# EAGLE design Micromouse-v15 (EAGLE 5.05)
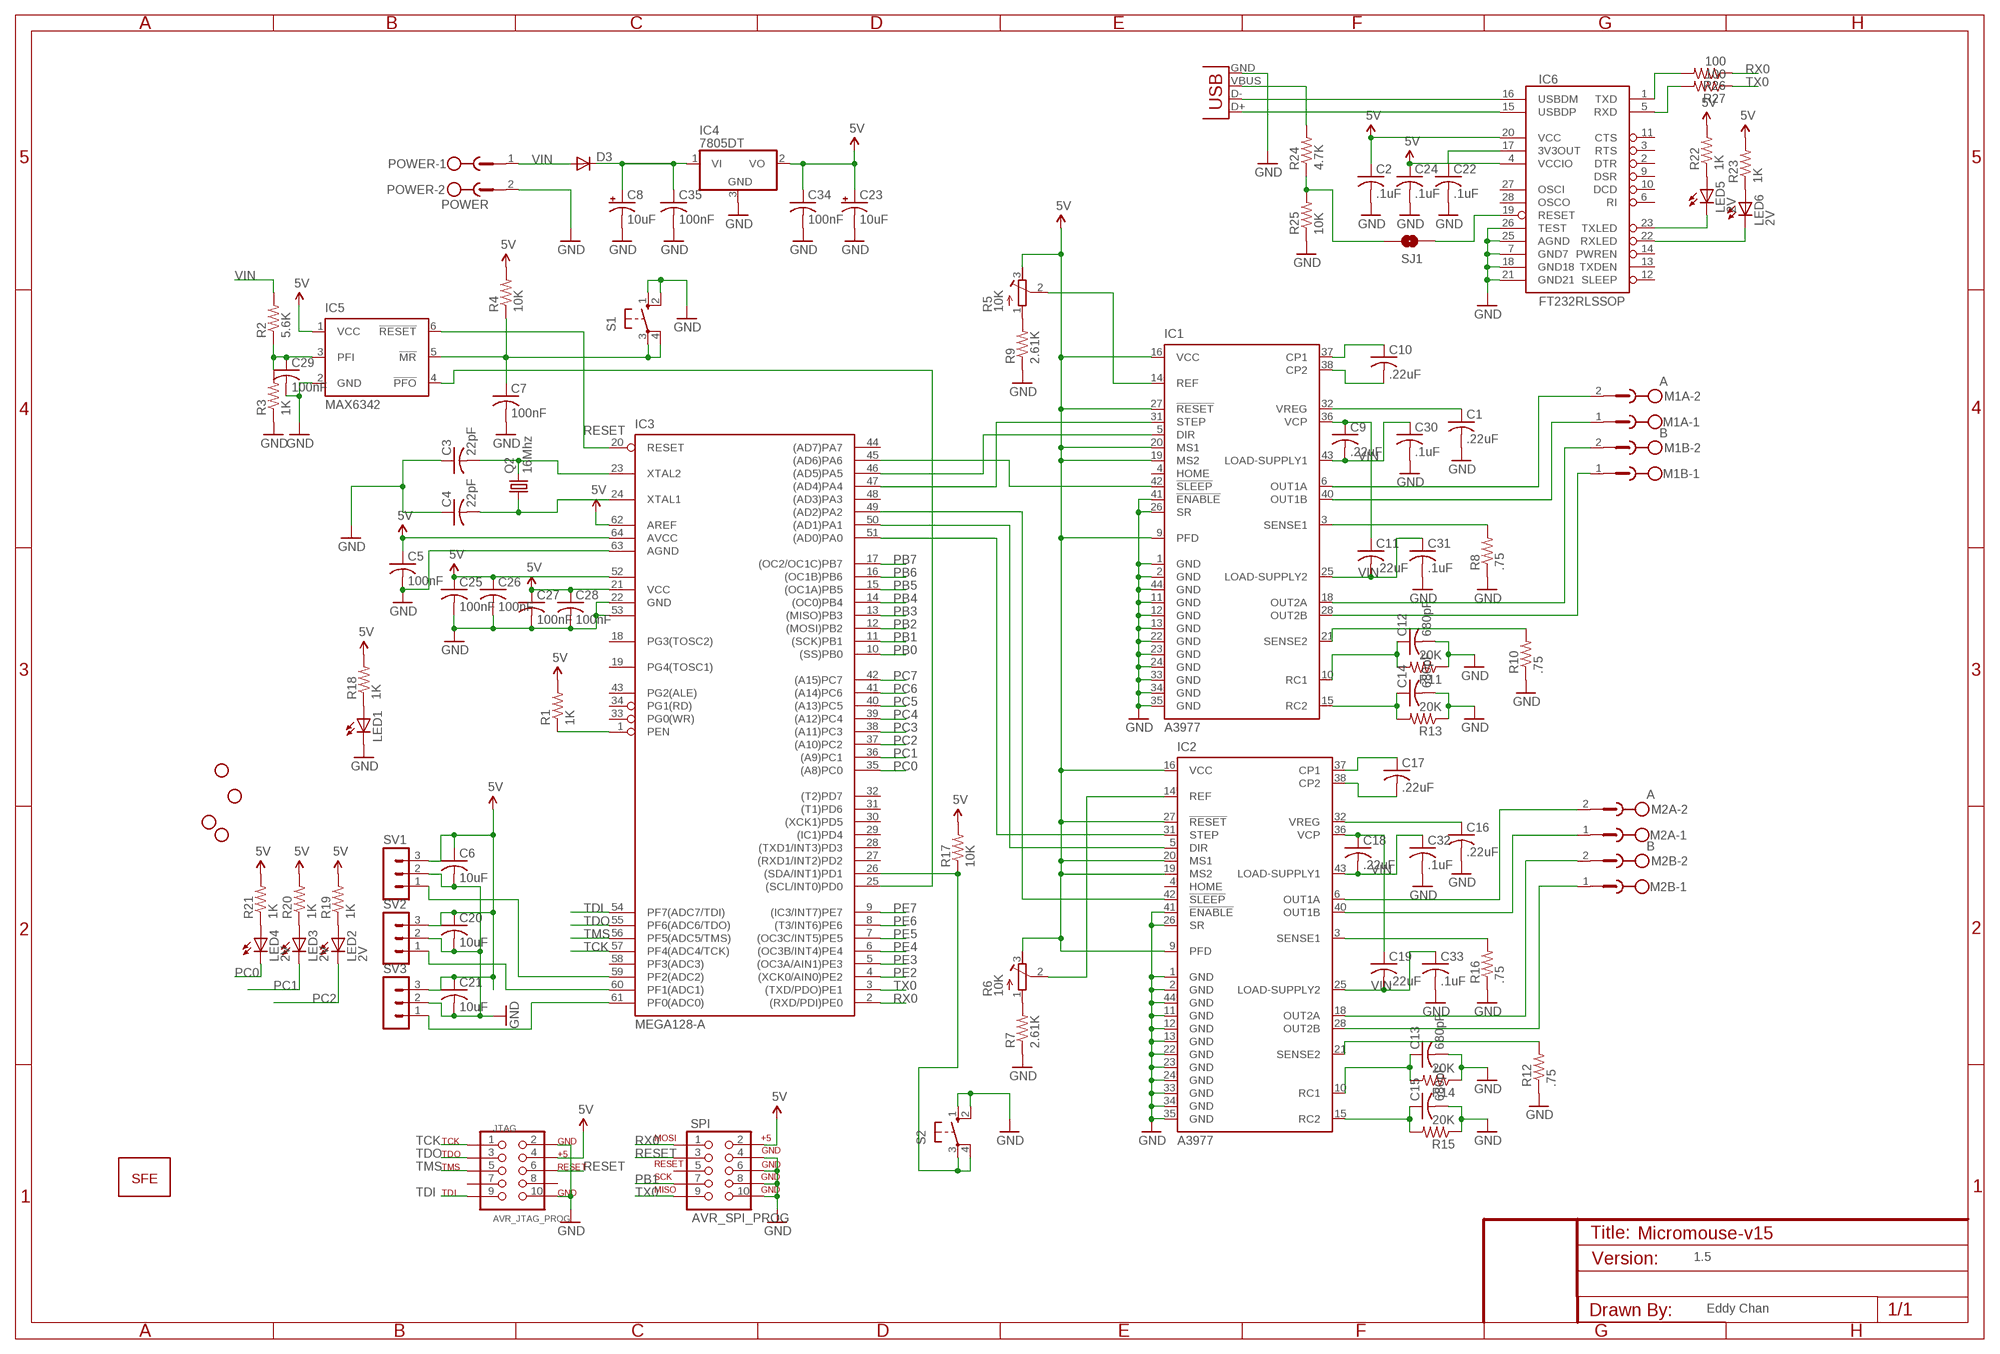
[diagram p0: schematic, sheet 1]

## Parts
C1  .22uF  C-USC0805  [C0805]
C2  .1uF  C-USC0805  [C0805]
C3  22pF  C-USC0805  [C0805]
C4  22pF  C-USC0805  [C0805]
C5  100nF  C-USC0805  [C0805]
C6  10uF  C-USC1206  [C1206]
C7  100nF  C-USC0805  [C0805]
C8  10uF  CAP_POL1206  [EIA3216]
C9  .22uF  C-USC0805  [C0805]
C10  .22uF  C-USC0805  [C0805]
C11  .22uF  C-USC0805  [C0805]
C12  680pF  C-USC0805  [C0805]
C13  680pF  C-USC0805  [C0805]
C14  680pF  C-USC0805  [C0805]
C15  680pF  C-USC0805  [C0805]
C16  .22uF  C-USC0805  [C0805]
C17  .22uF  C-USC0805  [C0805]
C18  .22uF  C-USC0805  [C0805]
C19  .22uF  C-USC0805  [C0805]
C20  10uF  C-USC1206  [C1206]
C21  10uF  C-USC1206  [C1206]
C22  .1uF  C-USC0805  [C0805]
C23  10uF  CAP_POL1206  [EIA3216]
C24  .1uF  C-USC0805  [C0805]
C25  100nF  C-USC0805  [C0805]
C26  100nF  C-USC0805  [C0805]
C27  100nF  C-USC0805  [C0805]
C28  100nF  C-USC0805  [C0805]
C29  100nF  C-USC0805  [C0805]
C30  .1uF  C-USC0805  [C0805]
C31  .1uF  C-USC0805  [C0805]
C32  .1uF  C-USC0805  [C0805]
C33  .1uF  C-USC0805  [C0805]
C34  100nF  C-USC0805  [C0805]
C35  100nF  C-USC0805  [C0805]
D3  DIODESMB  [SMB-DIODE]
IC1  A3977  [PLCC44]
IC2  A3977  [PLCC44]
IC3  MEGA128-A  [TQFP64]
IC4  7805DT  [TO252]
IC5  MAX6342  [SOT23-6L]
IC6  FT232RLSSOP  [SSOP28DB]
JTAG  AVR_JTAG_PROG  [AVR_ICSP]
LED1  LEDCHIP-LED0805  [CHIP-LED0805]
LED2  2V  LEDCHIP-LED0805  [CHIP-LED0805]
LED3  2V  LEDCHIP-LED0805  [CHIP-LED0805]
LED4  2V  LEDCHIP-LED0805  [CHIP-LED0805]
LED5  2V  LEDCHIP-LED0805  [CHIP-LED0805]
LED6  2V  LEDCHIP-LED0805  [CHIP-LED0805]
M1A  A  MSTBV2  [MSTBV2]
M1B  B  MSTBV2  [MSTBV2]
M2A  A  MSTBV2  [MSTBV2]
M2B  B  MSTBV2  [MSTBV2]
POWER  POWER  MSTBV2  [MSTBV2]
Q2  16Mhz  CRYSTALHC49US  [HC49US]
R1  1K  RESISTOR  [0805]
R2  5.6K  RESISTOR  [0805]
R3  1K  RESISTOR  [0805]
R4  10K  RESISTOR  [0805]
R5  10K  R-TRIMM3103  [RTRIM3103]
R6  10K  R-TRIMM3103  [RTRIM3103]
R7  2.61K  RESISTOR  [0805]
R8  .75  RESISTOR  [0805]
R9  2.61K  RESISTOR  [0805]
R10  .75  RESISTOR  [0805]
R11  20K  RESISTOR  [0805]
R12  .75  RESISTOR  [0805]
R13  20K  RESISTOR  [0805]
R14  20K  RESISTOR  [0805]
R15  20K  RESISTOR  [0805]
R16  .75  RESISTOR  [0805]
R17  10K  RESISTOR  [0805]
R18  1K  RESISTOR  [0805]
R19  1K  RESISTOR  [0805]
R20  1K  RESISTOR  [0805]
R21  1K  RESISTOR  [0805]
R22  1K  RESISTOR  [0805]
R23  1K  RESISTOR  [0805]
R24  4.7K  RESISTOR  [0805]
R25  10K  RESISTOR  [0805]
R26  100  RESISTOR  [0805]
R27  100  RESISTOR  [0805]
S1  10-XX  [B3F-10XX]
S2  10-XX  [B3F-10XX]
SJ1  SOLDERJUMPERNC  [SJ_2S]
SPI  AVR_SPI_PROG  [AVR_ICSP]
SV1  MA03-1  [MA03-1]
SV2  MA03-1  [MA03-1]
SV3  MA03-1  [MA03-1]
U$19  STAND-OFF  [STAND-OFF]
U$20  STAND-OFF  [STAND-OFF]
U$21  STAND-OFF  [STAND-OFF]
U$22  STAND-OFF  [STAND-OFF]
U$23  LOGO-SFESK  [SFE-LOGO-FLAME]
X1  USBSMD  [USB-MINIB]

## Nets
5V: C2.1 C5.1 C6.1 C20.1 C21.1 C23.A(+) C24.1 C25.1 C26.1 C27.1 C28.1 C34.1 IC1.9(PFD) IC1.16(VCC) IC1.19(MS2) IC1.20(MS1) IC1.27(!RESET) IC2.9(PFD) IC2.16(VCC) IC2.19(MS2) IC2.20(MS1) IC2.27(!RESET) IC3.21(VCC) IC3.52(VCC1) IC3.62(AREF) IC3.64(AVCC) IC4.2(VO) IC5.1(VCC) IC6.4(VCCIO) IC6.20(VCC) JTAG.4 R1.2 R4.2 R5.3(A) R6.3(A) R17.2 R18.2 R19.2 R20.2 R21.2 R22.2 R23.2 SPI.2 SV1.3 SV2.3 SV3.3
GND: C1.2 C2.2 C3.1 C4.1 C5.2 C6.2 C7.2 C8.C(-) C12.2 C13.2 C14.2 C15.2 C16.2 C20.2 C21.2 C22.2 C23.C(-) C24.2 C25.2 C26.2 C27.2 C28.2 C29.2 C30.2 C31.2 C32.2 C33.2 C34.2 C35.2 IC1.1(GND) IC1.2(GND) IC1.11(GND) IC1.12(GND) IC1.13(GND) IC1.22(GND) IC1.23(GND) IC1.24(GND) IC1.26(SR) IC1.33(GND) IC1.34(GND) IC1.35(GND) IC1.41(!ENABLE) IC1.44(GND) IC2.1(GND) IC2.2(GND) IC2.11(GND) IC2.12(GND) IC2.13(GND) IC2.22(GND) IC2.23(GND) IC2.24(GND) IC2.26(SR) IC2.33(GND) IC2.34(GND) IC2.35(GND) IC2.41(!ENABLE) IC2.44(GND) IC3.22(GND) IC3.53(GND1) IC3.63(AGND) IC4.3(GND) IC5.2(GND) IC6.7(GND7) IC6.18(GND18) IC6.21(GND21) IC6.25(AGND) IC6.26(TEST) JTAG.2 JTAG.10 LED1.C POWER.2 R3.1 R7.1 R8.1 R9.1 R10.1 R11.1 R12.1 R13.1 R14.1 R15.1 R16.1 R25.1 S1.1(S) S1.2(S1) S2.1(S) S2.2(S1) SPI.4 SPI.6 SPI.8 SPI.10 SV1.2 SV2.2 SV3.2 X1.GND
N$1: IC1.5(DIR) IC3.46((AD5)PA5)
N$2: IC1.31(STEP) IC3.47((AD4)PA4)
N$3: IC2.31(STEP) IC3.51((AD0)PA0)
N$4: IC2.5(DIR) IC3.50((AD1)PA1)
N$5: C8.A(+) C35.1 D3.C IC4.1(VI)
N$6: IC3.1(PEN) R1.1
N$7: C29.1 IC5.3(PFI) R2.1 R3.2
N$8: C3.2 IC3.23(XTAL2) Q2.2
N$9: C4.2 IC3.24(XTAL1) Q2.1
N$10: IC1.42(!SLEEP) IC3.45((AD6)PA6)
N$11: C7.1 IC5.5(!MR) R4.1 S1.3(P) S1.4(P1)
N$12: LED1.A R18.1
N$13: IC2.42(!SLEEP) IC3.49((AD2)PA2)
N$14: IC3.25((SCL/INT0)PD0) IC5.4(!PFO)
N$15: R5.1(E) R9.2
N$16: IC1.14(REF) R5.2(S)
N$17: R6.1(E) R7.2
N$18: IC2.14(REF) R6.2(S)
N$19: IC1.3(SENSE1) R8.2
N$20: IC1.21(SENSE2) R10.2
N$21: C1.1 IC1.32(VREG)
N$22: C10.1 IC1.37(CP1)
N$23: C10.2 IC1.38(CP2)
N$24: C9.1 C11.1 IC1.36(VCP)
N$25: IC2.21(SENSE2) R12.2
N$26: C12.1 IC1.10(RC1) R11.2
N$27: C14.1 IC1.15(RC2) R13.2
N$28: C13.1 IC2.10(RC1) R14.2
N$29: C15.1 IC2.15(RC2) R15.2
N$30: IC2.3(SENSE1) R16.2
N$31: C16.1 IC2.32(VREG)
N$32: C17.1 IC2.37(CP1)
N$33: C17.2 IC2.38(CP2)
N$34: C18.1 C19.1 IC2.36(VCP)
N$35: IC1.6(OUT1A) M1A.2
N$36: IC1.40(OUT1B) M1A.1
N$37: IC1.18(OUT2A) M1B.2
N$38: IC1.28(OUT2B) M1B.1
N$39: IC2.6(OUT1A) M2A.2
N$40: IC2.40(OUT1B) M2A.1
N$41: IC2.18(OUT2A) M2B.2
N$42: IC2.28(OUT2B) M2B.1
N$43: IC3.61(PF0(ADC0)) SV3.1
N$44: IC3.60(PF1(ADC1)) SV2.1
N$45: IC3.59(PF2(ADC2)) SV1.1
N$46: IC3.26((SDA/INT1)PD1) R17.1 S2.3(P) S2.4(P1)
N$47: LED2.A R19.1
N$48: LED3.A R20.1
N$49: LED4.A R21.1
N$50: R24.2 X1.VBUS
N$51: R24.1 R25.2 SJ1.2
N$52: IC6.16(USBDM) X1.D-
N$53: IC6.15(USBDP) X1.D+
N$54: C22.1 IC6.17(3V3OUT)
N$55: LED5.A R22.1
N$56: LED6.A R23.1
N$57: IC6.23(TXLED) LED5.C
N$58: IC6.22(RXLED) LED6.C
N$59: IC6.1(TXD) R26.2
N$60: IC6.5(RXD) R27.2
N$61: IC6.19(RESET) SJ1.1
PB0: IC3.10((SS)PB0)
PB1: IC3.11((SCK)PB1) SPI.7
PB2: IC3.12((MOSI)PB2)
PB3: IC3.13((MISO)PB3)
PB4: IC3.14((OC0)PB4)
PB5: IC3.15((OC1A)PB5)
PB6: IC3.16((OC1B)PB6)
PB7: IC3.17((OC2/OC1C)PB7)
PC0: IC3.35((A8)PC0) LED4.C
PC1: IC3.36((A9)PC1) LED3.C
PC2: IC3.37((A10)PC2) LED2.C
PC3: IC3.38((A11)PC3)
PC4: IC3.39((A12)PC4)
PC5: IC3.40((A13)PC5)
PC6: IC3.41((A14)PC6)
PC7: IC3.42((A15)PC7)
PE2: IC3.4((XCK0/AIN0)PE2)
PE3: IC3.5((OC3A/AIN1)PE3)
PE4: IC3.6((OC3B/INT4)PE4)
PE5: IC3.7((OC3C/INT5)PE5)
PE6: IC3.8((T3/INT6)PE6)
PE7: IC3.9((IC3/INT7)PE7)
RESET: IC3.20(RESET) IC5.6(!RESET) JTAG.6 SPI.3
RX0: IC3.2((RXD/PDI)PE0) R26.1 SPI.1
TCK: IC3.57(PF4(ADC4/TCK)) JTAG.1
TDI: IC3.54(PF7(ADC7/TDI)) JTAG.9
TDO: IC3.55(PF6(ADC6/TDO)) JTAG.3
TMS: IC3.56(PF5(ADC5/TMS)) JTAG.5
TX0: IC3.3((TXD/PDO)PE1) R27.1 SPI.9
VIN: C9.2 C11.2 C18.2 C19.2 C30.1 C31.1 C32.1 C33.1 D3.A IC1.25(LOAD-SUPPLY2) IC1.43(LOAD-SUPPLY1) IC2.25(LOAD-SUPPLY2) IC2.43(LOAD-SUPPLY1) POWER.1 R2.2
Unconnected: IC1.4(HOME) IC2.4(HOME) IC3.18(PG3(TOSC2)) IC3.19(PG4(TOSC1)) IC3.27((RXD1/INT2)PD2) IC3.28((TXD1/INT3)PD3) IC3.29((IC1)PD4) IC3.30((XCK1)PD5) IC3.31((T1)PD6) IC3.32((T2)PD7) IC3.33(PG0(WR)) IC3.34(PG1(RD)) IC3.43(PG2(ALE)) IC3.44((AD7)PA7) IC3.48((AD3)PA3) IC3.58(PF3(ADC3)) IC6.2(DTR) IC6.3(RTS) IC6.6(RI) IC6.9(DSR) IC6.10(DCD) IC6.11(CTS) IC6.12(SLEEP) IC6.13(TXDEN) IC6.14(PWREN) IC6.27(OSCI) IC6.28(OSCO) JTAG.7 JTAG.8 SPI.5

## Notes on the sheet
- 1.5
- Eddy Chan

## Library data of the parts
C1-C7 C9-C22 C24-C35 = rcl:C-US: CAPACITOR, American symbol
C8 C23 = SparkFun:CAP_POL: Capacitor Polarized These are standard SMD and PTH capacitors. Normally 10uF, 47uF, and 100uF in electrolytic and tantalum varieties. Always verify the external diameter of the through hole cap, it varies with capacity, voltage, and manufacturer. The EIA devices should be standard.
D3 = SparkFun:DIODE: Diode These are standard reverse protection diodes and small signal diodes. SMA package can handle up to about 1A. SOD-323 can handle about 200mA. What the SOD-323 package when ordering, there are some mfgs out there that are 5-pin packages.
IC1 IC2 = allegro:A3977: MICROSTEPPING DMOS DRIVER WITH TRANSLATOR Source: 3977.pdf
IC3 = atmel:MEGA128: MICROCONTROLLER 128 Kbytes FLASH 4 Kbytes SRAM 4 Kbytes EEPROM DUAL USART 8-channel 10 bit ADC Source: avr.lbr
IC4 = linear:78*: Positive VOLTAGE REGULATOR Source: http://cache.national.com/ds/LM/LM78L05.pdf http://www.fairchildsemi.com/ds/LM/LM7805.pdf
IC5 = maxim:MAX6342: RESET CIRCUIT
IC6 = SparkFun:FT232RL: USB UART FT232RL 4th Generation USB UART (USB <-> Serial) Controller. Spark Fun Electronics SKU : COM-00650
JTAG = SparkFun:AVR_JTAG_PROG
LED1-LED6 = led:LED: LED OSRAM: - CHIPLED LG R971, LG N971, LY N971, LG Q971, LY Q971, LO R971, LY R971 LH N974, LH R974 LS Q976, LO Q976, LY Q976 LO Q996 - Hyper CHIPLED LW Q18S LB Q993, LB Q99A, LB R99A - SideLED LS A670, LO A670, LY A670, LG A670, LP A670 LB A673, LV A673, LT A673, LW A673 LH A674 LY A675 LS A676, LA A676, LO A676, LY A676, LW A676 LS A679, LY A679, LG A679 - Hyper Micro SIDELED® LS Y876, LA Y876, LO Y876, LY Y876 LT Y87S - SmartLED LW L88C, LW L88S LB L89C, LB L89S, LG L890 LS L89K, LO L89K, LY L89K LS L896, LA L896, LO L896, LY L896 - TOPLED LS T670, LO T670, LY T670, LG T670, LP T670 LSG T670, LSP T670, LSY T670, LOP T670, LYG T670 LG T671, LOG T671, LSG T671 LB T673, LV T673, LT T673, LW T673 LH T674 LS T676, LA T676, LO T676, LY T676, LB T676, LH T676, LSB T676, LW T676 LB T67C, LV T67C, LT T67C, LS T67K, LO T67K, LY T67K, LW E67C LS E67B, LA E67B, LO E67B, LY E67B, LB E67C, LV E67C, LT E67C LW T67C LS T679, LY T679, LG T679 LS T770, LO T770, LY T770, LG T770, LP T770 LB T773, LV T773, LT T773, LW T773 LH T774 LS E675, LA E675, LY E675, LS T675 LS T776, LA T776, LO T776, LY T776, LB T776 LHGB T686 LT T68C, LB T68C - Hyper Mini TOPLED® LB M676 - Mini TOPLED Santana® LG M470 LS M47K, LO M47K, LY M47K Source: http://www.osram.convergy.de LUXEON: - LUMILED® LXK2-PW12-R00, LXK2-PW12-S00, LXK2-PW14-U00, LXK2-PW14-V00 LXK2-PM12-R00, LXK2-PM12-S00, LXK2-PM14-U00 LXK2-PE12-Q00, LXK2-PE12-R00, LXK2-PE12-S00, LXK2-PE14-T00, LXK2-PE14-U00 LXK2-PB12-K00, LXK2-PB12-L00, LXK2-PB12-M00, LXK2-PB14-N00, LXK2-PB14-P00, LXK2-PB14-Q00 LXK2-PR12-L00, LXK2-PR12-M00, LXK2-PR14-Q00, LXK2-PR14-R00 LXK2-PD12-Q00, LXK2-PD12-R00, LXK2-PD12-S00 LXK2-PH12-R00, LXK2-PH12-S00 LXK2-PL12-P00, LXK2-PL12-Q00, LXK2-PL12-R00 Source: www.luxeon.com KINGBRIGHT: KA-3528ASYC Source: www.kingbright.com
M1A M1B M2A M2B POWER = con-phoenix-500:MSTBV2: PHOENIX
Q2 = SparkFun:CRYSTAL: Crystals Various standard crystals. Proven footprints. Spark Fun Electronics SKU : COM-00534
R1-R4 R7-R27 = SparkFun:RESISTOR: Resistor Basic schematic elements and footprints for 0603, 1206, and PTH 1/10th watt (small) resistors.
R5 R6 = rcl:R-TRIMM: Trimm resistor
S1 S2 = switch-omron:10-XX: OMRON SWITCH
SJ1 = SparkFun:SOLDERJUMPER: Solder Jumper Standard SMD solder jumper. Used to automate production. Two varients : Normally Open and Normally Closed are the same, but have different paste layers. NC will have a large amount of paste and should jumper during reflow.
SPI = SparkFun:AVR_SPI_PROG: AVR ICSP Header This is the standard AVR In Circuit Serial Programming header. Minimal, but includes pin one indicator. Works with standard Olimex programmers. Also look for the 6-pin reduced version. Spark Fun Electronics SKU: PRT-00778
SV1-SV3 = con-lstb:MA03-1: PIN HEADER
U$19-U$22 = SparkFun:STAND-OFF: Stand Off This is the mechanical footprint for a #4 phillips button head screw. Use the keepout ring to avoid running the screw head into surrounding components. SKU : PRT-00447
U$23 = SparkFun:LOGO-SFE: Spark Fun Electronics PCB Logo This is the standard Spark Fun Electronics PCB logo.
X1 = SparkFun:USB: USB Connectors USB-B-PTH is fully proven SKU : PRT-00139 USB-miniB is fully proven SKU : PRT-00587 USB-A-PCB is untested. USB-A-H is throughly reviewed, but untested. Spark Fun Electronics SKU : PRT-00437 USB-B-SMT is throughly reviewed, but untested. Needs silkscreen touching up. USB-A-S has not been used/tested USB-MB-H has not been used/tested

## Board
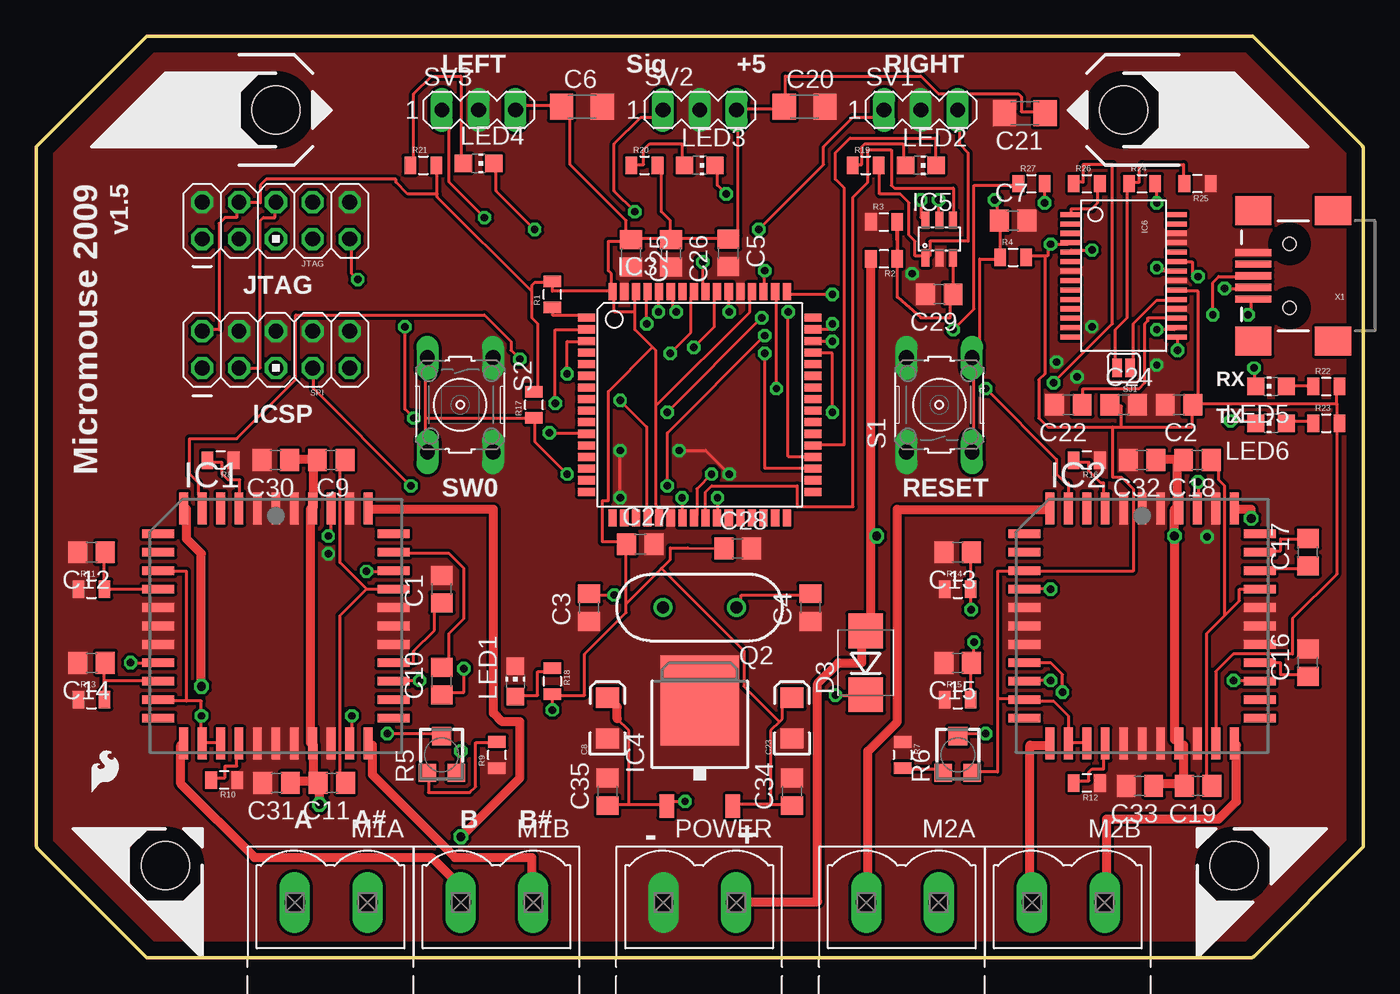
[diagram p1: board, top side]
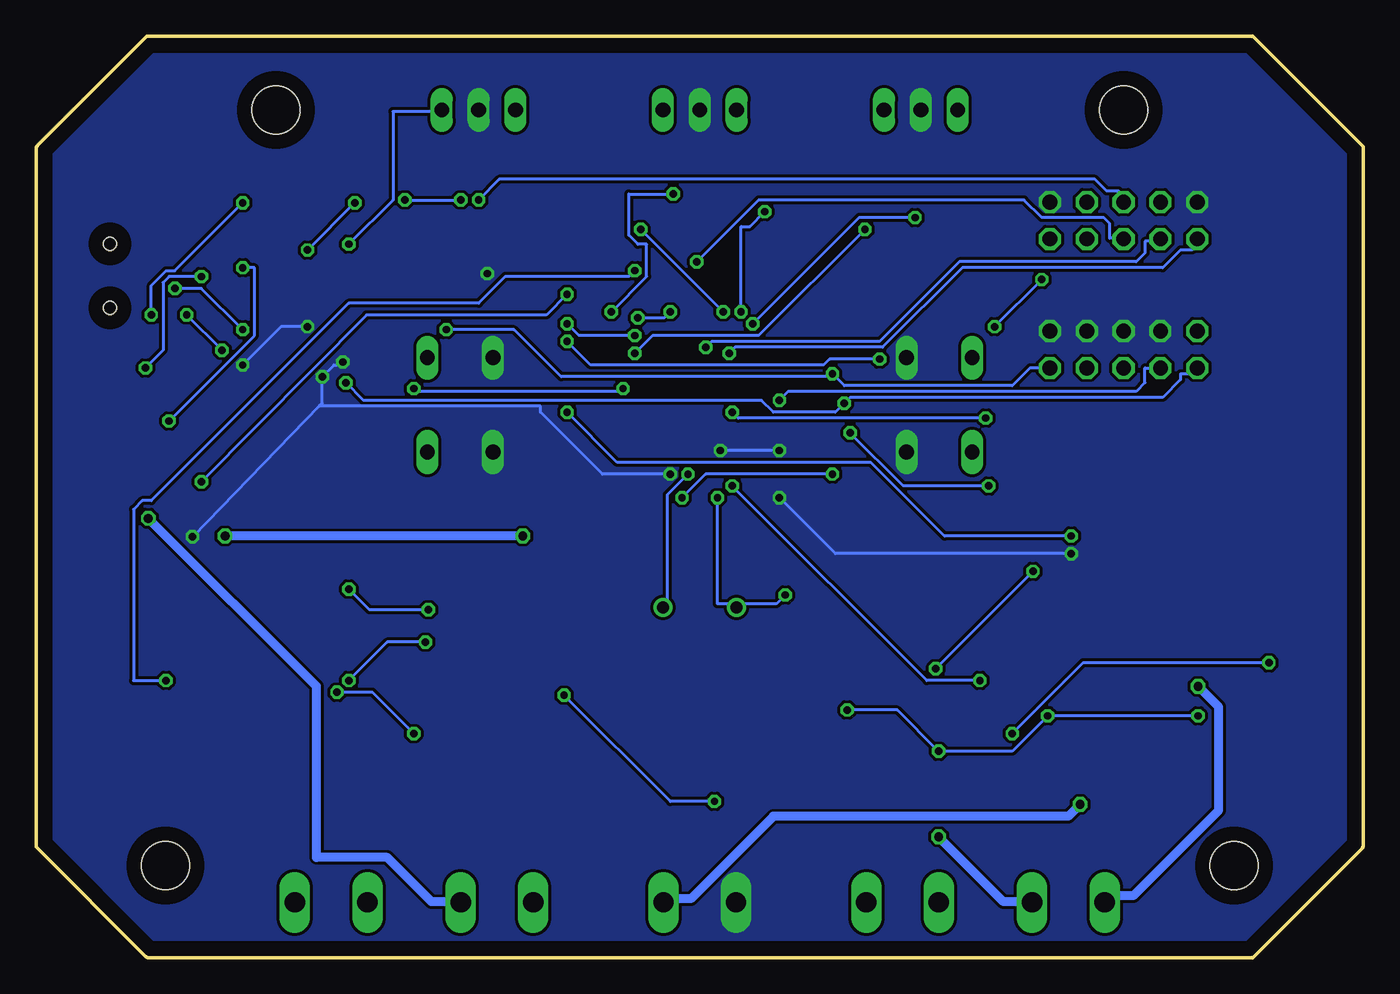
[diagram p2: board, bottom side, seen from below]

Size 91.44 x 63.5 mm. Coordinates in mm from the lower left corner, seen from the top.
Outline: 7.62,63.5 0,55.88 0,7.72 arc45 0.07,7.55 7.62,0 83.72,0 arc45 83.89,0.07 91.44,7.62 91.44,55.77 arc45 91.37,55.95 83.82,63.5 7.62,63.5
Copper layers (1*16): Top 0.035mm / dielectric 1.5mm / Bottom 0.035mm
Design rules "default *": minimum track width 8mil, minimum drill 8mil, track to track 8mil, track to pad 8mil, pad to pad 8mil, via to via 8mil, smd to smd 8mil, copper to edge 40mil, drill to drill 8mil, minimum pad ring 10mil, minimum via ring 8mil, stop-mask expansion 4mil, vias tented up to drill 0mil, thermal gap 10mil

### Footprints (pad centres in the part's own frame; a part is rotated, then mirrored left to right if it is on the bottom)
C0805 = smd 1.3 x 1.5: 1 -0.95,0; 2 0.95,0
C1206 = smd 1.6 x 1.8: 1 -1.4,0; 2 1.4,0
EIA3216 = smd 1.4 x 1.6: A 1.4,0; C -1.4,0
SMB-DIODE = smd 2.4 x 2.4: A 2.2,0; C -2.2,0
PLCC44 = smd 0.6 x 2.2: 1 0,8.1; 2 -1.27,8.1; 3 -2.54,8.1; 4 -3.81,8.1; 5 -5.08,8.1; 6 -6.35,8.1; 18 -6.35,-8.1; 19 -5.08,-8.1; 20 -3.81,-8.1; 21 -2.54,-8.1; 22 -1.27,-8.1; 23 0,-8.1; 24 1.27,-8.1; 25 2.54,-8.1; 26 3.81,-8.1; 27 5.08,-8.1; 28 6.35,-8.1; 40 6.35,8.1; 41 5.08,8.1; 42 3.81,8.1; 43 2.54,8.1; 44 1.27,8.1 | smd 2.2 x 0.6: 7 -8.1,6.35; 8 -8.1,5.08; 9 -8.1,3.81; 10 -8.1,2.54; 11 -8.1,1.27; 12 -8.1,0; 13 -8.1,-1.27; 14 -8.1,-2.54; 15 -8.1,-3.81; 16 -8.1,-5.08; 17 -8.1,-6.35; 29 8.1,-6.35; 30 8.1,-5.08; 31 8.1,-3.81; 32 8.1,-2.54; 33 8.1,-1.27; 34 8.1,0; 35 8.1,1.27; 36 8.1,2.54; 37 8.1,3.81; 38 8.1,5.08; 39 8.1,6.35
TQFP64 = smd 1.194 x 0.559: 1 -7.8,6; 2 -7.8,5.2; 3 -7.8,4.4; 4 -7.8,3.6; 5 -7.8,2.8; 6 -7.8,2; 7 -7.8,1.2; 8 -7.8,0.4; 9 -7.8,-0.4; 10 -7.8,-1.2; 11 -7.8,-2; 12 -7.8,-2.8; 13 -7.8,-3.6; 14 -7.8,-4.4; 15 -7.8,-5.2; 16 -7.8,-6; 33 7.8,-6; 34 7.8,-5.2; 35 7.8,-4.4; 36 7.8,-3.6; 37 7.8,-2.8; 38 7.8,-2; 39 7.8,-1.2; 40 7.8,-0.4; 41 7.8,0.4; 42 7.8,1.2; 43 7.8,2; 44 7.8,2.8; 45 7.8,3.6; 46 7.8,4.4; 47 7.8,5.2; 48 7.8,6 | smd 0.559 x 1.194: 17 -6,-7.8; 18 -5.2,-7.8; 19 -4.4,-7.8; 20 -3.6,-7.8; 21 -2.8,-7.8; 22 -2,-7.8; 23 -1.2,-7.8; 24 -0.4,-7.8; 25 0.4,-7.8; 26 1.2,-7.8; 27 2,-7.8; 28 2.8,-7.8; 29 3.6,-7.8; 30 4.4,-7.8; 31 5.2,-7.8; 32 6,-7.8; 49 6,7.8; 50 5.2,7.8; 51 4.4,7.8; 52 3.6,7.8; 53 2.8,7.8; 54 2,7.8; 55 1.2,7.8; 56 0.4,7.8; 57 -0.4,7.8; 58 -1.2,7.8; 59 -2,7.8; 60 -2.8,7.8; 61 -3.6,7.8; 62 -4.4,7.8; 63 -5.2,7.8; 64 -6,7.8
TO252 = smd 1 x 1.6: 1 -2.28,-4.8; 2 2.28,-4.8 | smd 5.4 x 6.2: 3 0,2.5
SOT23-6L = smd 0.55 x 1.2: 1 -0.95,-1.3; 2 0,-1.3; 3 0.95,-1.3; 4 0.95,1.3; 5 0,1.3; 6 -0.95,1.3
SSOP28DB = smd 0.348 x 1.397: 1 -4.225,-3.656; 2 -3.575,-3.656; 3 -2.925,-3.656; 4 -2.275,-3.656; 5 -1.625,-3.656; 6 -0.975,-3.656; 7 -0.325,-3.656; 8 0.325,-3.656; 9 0.975,-3.656; 10 1.625,-3.656; 11 2.275,-3.656; 12 2.925,-3.656; 13 3.575,-3.656; 14 4.225,-3.656; 15 4.225,3.656; 16 3.575,3.656; 17 2.925,3.656; 18 2.275,3.656; 19 1.625,3.656; 20 0.975,3.656; 21 0.325,3.656; 22 -0.325,3.656; 23 -0.975,3.656; 24 -1.625,3.656; 25 -2.275,3.656; 26 -2.925,3.656; 27 -3.575,3.656; 28 -4.225,3.656
AVR_ICSP = drill 1.016 octagon: 1 -1.27,5.08; 2 1.27,5.08; 3 -1.27,2.54; 4 1.27,2.54; 5 -1.27,0; 6 1.27,0; 7 -1.27,-2.54; 8 1.27,-2.54; 9 -1.27,-5.08; 10 1.27,-5.08
CHIP-LED0805 = smd 1.2 x 1.2: A 0,-1.05; C 0,1.05
MSTBV2 = drill 1.397 long: 1 -2.5,0; 2 2.5,0
HC49US = drill 0.813 round: 1 -2.54,0; 2 2.54,0
0805 = smd 0.8 x 1.2: 1 -0.9,0; 2 0.9,0
RTRIM3103 = smd 1.2 x 1.25: 1 -1,-1.225; 3 1,-1.225 | smd 1.3 x 1.3: 2 0,1.3
B3F-10XX = drill 1.016 long: 1 -3.251,2.261; 2 3.251,2.261; 3 -3.251,-2.261; 4 3.251,-2.261
SJ_2S = smd 0.635 x 1.27: 1 -0.45,0; 2 0.45,0
MA03-1 = drill 1.016 long: 1 -2.54,0; 2 0,0; 3 2.54,0
STAND-OFF = hole 3.302: 0,0
USB-MINIB = smd 2.5 x 0.5: D+ 2.5,0; D- 2.5,0.8; GND 2.5,-1.6; ID 2.5,-0.8; VBUS 2.5,1.6 | smd 2.5 x 2: GND@1 -3,-4.5; GND@2 -3,4.5; GND@3 2.5,4.5; GND@4 2.5,-4.5 | hole 0.9: 0,2.2; 0,-2.2

### Placement (x,y rotation side)
C1  27.94,25.4 90 top
C2  78.74,38.1 180 top
C3  38.1,24.13 90 top
C4  53.34,24.13 90 top
C5  47.68,48.57 270 top
C6  37.6,58.64 0 top
C7  67.31,50.8 0 top
C8  39.37,16.51 90 top
C9  20.32,34.29 180 top
C10  27.94,19.05 90 top
C11  20.37,12.04 180 top
C12  3.81,27.94 180 top
C13  63.5,27.94 180 top
C14  3.81,20.32 180 top
C15  63.5,20.32 180 top
C16  87.63,20.32 90 top
C17  87.63,27.94 90 top
C18  80.01,34.29 180 top
C19  80.06,11.84 180 top
C20  52.94,58.64 0 top
C21  68.12,58.2 180 top
C22  71.12,38.1 180 top
C23  52.07,16.51 90 top
C24  74.93,38.1 0 top
C25  40.99,48.54 270 top
C26  43.74,48.54 270 top
C27  41.62,28.49 0 top
C28  48.33,28.21 0 top
C29  62.23,45.72 180 top
C30  16.51,34.29 180 top
C31  16.56,12.04 180 top
C32  76.2,34.29 180 top
C33  76.05,11.84 180 top
C34  52.07,11.43 90 top
C35  39.37,11.43 90 top
D3  57.15,20.32 90 top
IC1  16.51,22.86 0 top
IC2  76.2,22.86 0 top
IC3  45.72,38.1 0 top
IC4  45.72,15.24 0 top
IC5  62.23,49.53 0 top
IC6  74.93,46.99 270 top
JTAG  16.51,50.8 90 top
LED1  33.02,19.05 0 top
LED2  60.96,54.61 270 top
LED3  45.72,54.61 270 top
LED4  30.48,54.74 270 top
LED5  85.09,39.37 90 top
LED6  85.09,36.83 90 top
M1A  20.32,3.81 180 top
M1B  31.75,3.81 180 top
M2A  59.69,3.81 180 top
M2B  71.12,3.81 180 top
POWER  45.72,3.81 180 top
Q2  45.72,24.13 180 top
R1  35.56,45.72 90 top
R2  58.42,48.16 180 top
R3  58.42,50.7 0 top
R4  67.31,48.26 0 top
R5  27.94,13.97 0 top
R6  63.5,13.97 0 top
R7  59.69,13.97 270 top
R8  12.7,34.29 180 top
R9  31.75,13.97 90 top
R10  12.95,12.24 180 top
R11  3.81,25.4 0 top
R12  72.39,12.04 180 top
R13  3.81,17.78 0 top
R14  63.5,25.4 0 top
R15  63.5,17.78 0 top
R16  72.39,34.29 180 top
R17  34.29,38.1 90 top
R18  35.56,19.05 270 top
R19  57.15,54.61 0 top
R20  41.91,54.61 0 top
R21  26.67,54.61 0 top
R22  88.9,39.37 0 top
R23  88.9,36.83 0 top
R24  76.2,53.34 0 top
R25  80.01,53.34 180 top
R26  72.39,53.34 0 top
R27  68.58,53.34 0 top
S1  62.23,38.1 90 top
S2  29.21,38.1 270 top
SJ1  74.93,40.64 180 top
SPI  16.51,41.91 90 top
SV1  60.96,58.42 0 top
SV2  45.72,58.42 0 top
SV3  30.48,58.42 0 top
U$19  8.89,6.35 0 top
U$20  82.55,6.35 0 top
U$21  16.51,58.42 0 top
U$22  74.93,58.42 0 top
U$23  3.81,11.43 0 top
X1  86.36,46.99 180 top

### Tracks (layer width: path | path; a pad name or v marks a point on that pad's centre or on a via)
5V  (via drill 0.51)
  Top 0.203: IC1.20 12.6,14.83 11.58,14.83 IC1.19 11.38,14.83 v11.38,16.66 11.38,17.68 10.36,17.68 | 10.36,17.68 8.53,17.68 IC1.16 | 10.36,17.68 10.36,26.62 8.53,26.62 IC1.9 | 50.6,10.57 48.16,10.57 IC4.2 | 50.6,10.57 52.02,10.57 C34.1 | 51.21,16.26 50.6,15.65 50.6,10.57 | 51.21,16.26 51.41,16.46 51.41,17.27 52.02,17.88 C23.A | 35.56,18.09 37.8,18.09 37.8,20.93 40.64,23.77 40.64,24.38 | 40.64,24.38 40.64,28.45 C27.1 40.64,28.65 39.01,28.65 39.01,31.5 39.42,31.5 39.42,39.01 42.47,42.06 | v29.26,14.22 29.26,13.01 29.06,12.8 R5.3 | v35.56,17.07 35.56,18.09 | 35.56,18.09 R18.2 | 40.64,24.38 43.08,26.82 | 43.08,26.82 43.69,27.43 43.69,28.25 44.91,28.25 C28.1 | v21.74,16.66 21.74,14.83 IC1.27 | 51.21,16.26 48.77,18.69 48.77,21.13 43.08,26.82 | 71.12,14.83 72.34,14.83 IC2.20 | 66.24,17.88 66.24,12.8 64.62,12.8 R6.3 | 66.24,17.88 68.07,17.88 IC2.16 68.28,17.68 70.1,17.68 71.12,16.66 71.12,14.83 | 66.24,17.88 66.24,26.62 68.07,26.62 IC2.9 68.28,26.62 75.59,26.62 75.59,32.31 74.78,33.12 74.17,33.12 74.17,36.58 | 71.12,14.83 IC2.19 | 69.49,48.36 69.7,48.36 69.7,48.97 v69.9,49.17 71.12,49.17 IC6.4 | 69.49,48.36 68.28,48.36 R4.2 | 89.61,38.2 89.61,39.22 R22.2 | 89.61,38.2 89.61,36.98 R23.2 89.61,36.78 89.61,26.42 86.56,23.37 86.56,20.93 82.5,20.93 81.28,19.71 IC2.27 | 79.86,38.2 80.06,38.41 80.06,45.92 78.64,45.92 IC6.20 | 74.78,36.58 74.78,38 74.17,38 C24.1 | 74.78,36.58 79.65,36.58 79.65,38 C2.1 79.86,38.2 | 79.86,38.2 89.61,38.2 | 69.49,48.36 69.49,40.23 69.09,39.83 69.09,37.19 69.7,36.58 74.17,36.58 | 74.17,36.58 74.78,36.58 | R19.2 58.12,54.46 58.12,52.63 59.54,52.63 60.15,52.02 60.15,49.78 60.55,49.38 60.55,48.36 61.16,48.36 IC5.1 61.37,48.36 61.57,48.36 61.57,49.38 64.21,49.38 64.21,55.47 63.6,56.08 63.6,58.32 SV1.3
  Top 0.203: 63.6,59.54 67.67,59.54 67.87,59.33 67.87,58.32 69.49,58.32 C21.1 | 63.6,59.54 63.6,58.52 SV1.3 | SV3.3 33.12,58.52 33.12,58.73 36.17,58.73 C6.1 36.37,58.52 36.78,58.12 36.78,54.66 40.64,50.8 40.64,49.78 40.84,49.58 C25.1 | 63.6,59.54 62.18,59.54 60.96,60.76 51.61,60.76 51.61,58.73 C20.1 51.41,58.52 48.36,58.52 SV2.3 48.36,58.32 48.36,49.78 48.16,49.58 C5.1 47.95,49.58 43.89,49.58 C26.1 43.69,49.58 | 63.6,59.54 SV1.3 | 41.25,44.5 39.83,44.5 39.83,45.72 IC3.64 39.62,45.92 | 41.25,44.5 41.25,45.72 IC3.62 | 42.67,38 42.67,41.86 42.47,42.06 | 42.67,38 42.67,31.29 42.88,30.48 IC3.21 | 42.47,42.06 41.25,43.28 41.25,44.5 | 42.67,38 49.17,44.5 49.17,45.72 IC3.52 | 43.69,49.58 43.69,50.8 43.08,51.41 43.08,54.25 42.88,54.46 R20.2 | 43.69,49.58 41.05,49.58 C25.1 | 39.62,45.92 39.62,47.14 39.42,47.35 39.42,49.38 40.84,49.38 C25.1 | SPI.2 11.58,43.28 12.6,43.28 12.6,50.6 13.01,51 13.82,51 13.82,52.02 JTAG.4 14.02,52.02 15.44,52.02 15.44,53.24 15.85,53.65 24.79,53.65 24.79,53.44 25.6,52.63 27.64,52.63 | 34.14,45.92 34.14,46.33 34.34,46.53 35.56,46.53 | 34.14,45.92 34.14,44.09 34.54,43.69 34.54,39.22 34.34,39.01 R17.2 | 27.64,52.63 27.64,52.43 34.14,45.92 | 27.64,52.63 27.64,54.46 R21.2 | 39.62,45.92 35.56,45.92 35.56,46.53 | 35.56,46.53 R1.2
  Bottom 0.203: v35.56,17.07 32.11,17.07 v29.26,14.22 24.18,14.22 v21.74,16.66 v11.38,16.66 | v69.9,49.17 66.85,52.22 66.85,58.32 63.6,58.32 SV1.3
GND  (via drill 0.51)
  Top 0.203: v47.75,33.33 46.13,34.95 v44.3,34.95 | v40.23,31.7 v40.23,34.95
  Bottom 0.203: v77.22,40.84 74.57,43.48 v72.75,43.48 | v70.31,41.05 70.51,40.84 70.92,40.84 v71.73,40.03 71.73,38.2 71.93,38 | 71.93,38 v80.67,29.01 | 71.93,38 56.69,38 56.69,37.59 52.43,33.33 v47.75,33.33 | v40.23,34.95 v44.3,34.95 | v40.23,31.7 36.37,27.84 v20.12,27.84
  other vias: 60.35,47.14
  pour Top (no thermals): 0.41,55.68 0.41,7.72 7.72,0.41 83.72,0.41 91.03,7.72 91.03,55.68 83.72,62.99 7.72,62.99
  pour Bottom (no thermals): 0.41,55.68 0.41,7.72 7.72,0.41 83.72,0.41 91.03,7.72 91.03,55.68 83.72,62.99 7.72,62.99
N$1  (via drill 0.51)
  Top 0.203: v54.86,42.47 53.65,42.47 IC3.46 | v33.33,41.25 32.72,41.86 32.72,42.47 30.89,44.3 17.88,44.3 17.88,39.83 13.82,35.76 10.57,35.76 10.57,33.33 11.18,32.72 11.18,31.9 11.38,31.7 11.38,31.09 IC1.5
  Bottom 0.203: v54.86,42.47 53.24,40.84 37.19,40.84 36.78,41.25 v33.33,41.25
N$2  (via drill 0.51)
  Top 0.203: v54.86,43.69 54.86,43.28 53.65,43.28 IC3.47 | v50.19,42.88 43.48,36.17 v43.48,32.51 | v26.42,19.1 24.79,19.1 IC1.31
  Bottom 0.203: v54.86,43.69 54.05,42.88 v50.19,42.88 | v43.48,32.51 30.07,19.1 v26.42,19.1
N$3  (via drill 0.51)
  Top 0.203: v50.19,47.35 50.19,45.92 IC3.51 | v82.5,19.1 84.12,19.1 IC2.31
  Bottom 0.203: v50.19,47.35 50.6,46.94 59.13,46.94 60.96,45.11 69.9,45.11 83.52,31.5 84.12,31.5 84.73,30.89 84.73,19.1 v82.5,19.1
N$4  (via drill 0.51)
  Top 0.203: v51,39.22 51,45.72 IC3.50 | v65.43,39.22 70.31,34.34 70.31,33.33 70.92,32.72 71.12,32.72 IC2.5
  Bottom 0.203: v51,39.22 51.21,39.01 65.23,39.01 v65.43,39.22
N$5  (via drill 0.51)
  Top 0.203: 40.84,10.57 43.28,10.57 IC4.1 43.48,10.57 43.48,10.77 v44.7,10.77 | 40.84,10.57 39.42,10.57 C35.1 | 40.03,17.27 39.42,17.88 C8.A | 40.03,16.46 40.84,15.65 40.84,10.57 | v55.07,18.09 57.1,18.09 D3.C
  Top 0.61: 40.03,16.46 40.03,17.27 C8.A
  Bottom 0.203: v55.07,18.09 47.75,10.77 v44.7,10.77
N$6
  Top 0.203: IC3.1 37.8,44.3 35.56,44.3 R1.1
N$7
  Top 0.203: R2.1 59.33,50.8 59.33,48.36 R3.2 59.33,48.16 59.33,45.52 60.96,44.09 62.99,44.09 62.99,45.72 C29.1 63.2,45.72 63.2,48.16 IC5.3
N$8  (via drill 0.51)
  Top 0.203: v44.5,31.7 44.5,30.48 IC3.23 | v39.83,24.99 38.2,24.99 C3.2
  Bottom 0.203: v44.5,31.7 44.5,24.38 43.48,24.38 | 43.48,24.38 43.28,24.18 Q2.2 43.48,24.38 | v39.83,24.99 40.44,24.38 43.48,24.38
N$9  (via drill 0.51)
  Top 0.203: v46.53,33.33 45.52,32.31 45.52,30.48 IC3.24 | C4.2 53.24,24.99 48.56,24.99 48.56,24.38 48.36,24.18 Q2.1
  Bottom 0.203: v46.53,33.33 47.95,31.9 47.95,24.18 48.16,24.18 Q2.1
N$10  (via drill 0.51)
  Top 0.203: v54.86,37.59 54.86,41.66 53.65,41.66 IC3.45 | v20.12,29.06 20.32,29.06 IC1.42
  Bottom 0.203: v54.86,37.59 51.41,34.14 33.93,34.14 28.85,29.06 v20.12,29.06
N$11  (via drill 0.51)
  Top 0.203: v62.18,52.22 62.18,51 IC5.5 | v66.04,52.22 66.24,52.22 66.24,50.8 C7.1 66.45,50.8 66.45,48.36 R4.1 66.24,48.16 65.02,48.16 65.02,41.86 64.62,41.45 S1.4 64.62,41.25 64.62,34.95 S1.3
  Bottom 0.203: v66.04,52.22 v62.18,52.22
N$12
  Top 0.203: LED1.A 33.12,18.09 34.54,18.09 34.54,19.71 35.56,19.71 R18.1
N$13  (via drill 0.51)
  Top 0.203: v54.86,45.72 51.82,45.72 IC3.49 | v80.06,32.79 80.06,31.09 IC2.42
  Bottom 0.203: v54.86,45.72 56.29,44.3 68.68,44.3 v80.06,32.79
N$14
  Top 0.203: IC3.25 46.13,30.48 46.13,32.11 46.53,32.51 52.43,32.51 52.43,31.09 56.29,31.09 56.29,52.43 57.3,53.44 57.3,55.68 58.93,55.68 58.93,53.24 59.13,53.03 63.2,53.03 63.2,51 IC5.4
N$15
  Top 0.203: R9.2 31.7,14.83 30.28,14.83 30.28,11.79 29.87,11.38 27.03,11.38 27.03,12.6 R5.1
N$16  (via drill 0.51)
  Top 0.203: v24.18,15.44 27.84,15.44 R5.2 | v6.5,20.32 IC1.14
  Bottom 0.203: v24.18,15.44 19.3,20.32 v6.5,20.32
N$17
  Top 0.203: R7.2 59.74,13.01 62.38,13.01 62.38,12.8 R6.1
N$18  (via drill 0.51)
  Top 0.203: v65.43,15.44 63.6,15.44 R6.2 | v70.71,18.29 70.71,19.51 69.9,20.32 IC2.14
  Bottom 0.203: v65.43,15.44 68.28,18.29 v70.71,18.29
N$19
  Top 0.203: R8.2 11.99,34.14 12.8,34.14 12.8,33.33 13.21,32.92 14.02,32.92 14.02,31.09 IC1.3
N$20
  Top 0.203: R10.2 12.19,12.39 13.01,12.39 13.01,13.21 13.82,13.21 13.82,14.63 IC1.21
N$21
  Top 0.203: C1.1 27.84,24.38 27.43,23.98 27.43,22.55 26.01,21.13 26.01,20.32 IC1.32
N$22  (via drill 0.51)
  Top 0.203: v29.46,19.91 29.46,18.29 28.04,18.29 C10.1 | v22.76,26.62 24.59,26.62 IC1.37
  Bottom 0.203: v29.46,19.91 v22.76,26.62
N$23
  Top 0.203: C10.2 28.04,20.12 28.45,20.52 28.45,22.35 29.46,23.37 29.46,26.82 28.45,27.84 24.79,27.84 IC1.38
N$24
  Top 0.203: 22.76,25.4 20.93,27.23 20.93,33.93 21.13,34.14 C9.1 | 22.76,25.4 IC1.36 | 22.76,25.4 20.93,23.57 20.93,12.39 21.13,12.19 C11.1
N$25
  Top 0.203: R12.2 71.53,12.19 72.54,12.19 72.54,12.8 72.75,13.01 73.56,13.01 73.56,14.63 IC2.21
N$26
  Top 0.203: C12.1 4.67,27.84 4.67,25.4 R11.2 IC1.10
N$27
  Top 0.203: 4.67,19.1 4.67,20.32 C14.1 | 4.67,19.1 4.67,17.88 R13.2 | 4.67,19.1 8.33,19.1 IC1.15
N$28  (via drill 0.51)
  Top 0.203: 64.41,25.4 64.41,27.84 C13.1 | v64.41,23.98 64.41,25.4 | v69.9,25.4 IC2.10 | 64.41,25.4 R14.2
  Bottom 0.203: v69.9,25.4 68.48,23.98 v64.41,23.98
N$29  (via drill 0.51)
  Top 0.203: R15.2 64.41,17.88 64.41,20.32 C15.1 64.62,20.32 v64.62,21.74 | v69.9,19.1 68.28,19.1 IC2.15
  Bottom 0.203: v69.9,19.1 67.26,21.74 v64.62,21.74
N$30
  Top 0.203: R16.2 71.53,34.14 72.54,34.14 72.54,33.53 73.36,32.72 73.56,32.72 73.56,31.09 IC2.3
N$31
  Top 0.203: C16.1 87.58,19.51 85.75,19.51 85.75,20.32 IC2.32
N$32
  Top 0.203: C17.1 87.58,26.82 84.33,26.82 IC2.37
N$33
  Top 0.203: C17.2 87.58,28.85 85.75,28.85 85.75,28.04 84.33,28.04 IC2.38
N$34
  Top 0.203: 81.89,23.57 82.91,24.59 82.91,25.4 IC2.36 | 81.89,23.57 80.67,22.35 80.67,12.19 80.87,11.99 C19.1 | 81.89,23.57 81.89,32.51 81.48,32.92 81.48,33.73 81.08,34.14 C18.1
N$35  (via drill 0.61)
  Top 0.61: v11.38,18.69 11.38,27.84 10.36,28.85 10.36,30.89 10.16,30.89 IC1.6
  Bottom 0.61: v11.38,18.69 9.96,17.27 9.96,10.16 15.85,4.27 17.27,4.27 17.68,3.86 M1A.2
N$36  (via drill 0.61)
  Top 0.61: v29.26,8.33 33.33,12.39 33.33,16.26 32.11,16.26 31.5,16.87 31.5,30.89 22.96,30.89 IC1.40
  Bottom 0.61: v29.26,8.33 24.79,3.86 22.96,3.86 M1A.1
N$37
  Top 0.61: IC1.18 10.16,14.63 9.96,14.63 9.96,11.99 15.04,6.91 27.23,6.91 28.65,5.49 28.85,5.49 28.85,4.06 29.06,3.86 M1B.2
N$38
  Top 0.61: IC1.28 22.96,14.63 23.16,14.63 23.16,12.6 28.85,6.91 34.14,6.91 34.14,3.86 M1B.1
N$39
  Top 0.61: IC2.6 69.7,30.89 59.33,30.89 59.33,16.26 57.3,14.22 57.3,3.86 M2A.2
N$40  (via drill 0.61)
  Top 0.61: v83.72,30.28 83.72,30.89 82.7,30.89 IC2.40
  Bottom 0.61: v83.72,30.28 72.14,18.69 72.14,6.91 67.26,6.91 64.21,3.86 62.38,3.86 M2A.1
N$41
  Top 0.61: IC2.18 69.7,14.63 68.48,14.63 68.48,3.86 M2B.2
N$42
  Top 0.61: IC2.28 82.7,14.63 82.7,10.77 81.48,9.55 73.76,9.55 73.76,3.86 M2B.1
N$43  (via drill 0.51)
  Top 0.203: v42.06,43.69 42.06,45.72 IC3.61 | v30.89,51 28.45,53.44 28.45,57.91 SV3.1
  Bottom 0.203: v42.06,43.69 34.75,51 v30.89,51
N$44  (via drill 0.51)
  Top 0.203: v42.88,44.5 42.88,45.72 IC3.60 | v41.25,51.41 39.83,52.83 39.83,56.08 41.66,57.91 43.08,57.91 43.08,58.32 SV2.1
  Bottom 0.203: v42.88,44.5 42.88,50.39 42.27,50.39 v41.25,51.41
N$45  (via drill 0.51)
  Top 0.203: v44.09,44.5 43.89,44.7 43.89,45.72 IC3.59 | v49.78,50.19 54.25,54.66 54.25,55.88 56.29,57.91 58.32,57.91 58.32,58.32 SV1.1
  Bottom 0.203: v44.09,44.5 v49.78,50.19
N$46  (via drill 0.51)
  Top 0.203: 26.82,37.19 26.82,41.25 S2.3 | 26.82,37.19 26.82,34.95 S2.4 | v46.94,31.7 46.94,30.48 IC3.26 | v36.58,33.33 34.34,35.56 34.34,37.19 R17.1 34.14,37.19 26.82,37.19
  Bottom 0.203: v46.94,31.7 45.31,33.33 v36.58,33.33
N$47
  Top 0.203: R19.1 56.29,54.66 56.9,54.66 56.9,55.88 57.1,56.08 59.74,56.08 59.74,54.66 LED2.A
N$48
  Top 0.203: R20.1 41.05,54.66 41.86,54.66 41.86,55.68 42.27,56.08 44.5,56.08 44.5,54.66 LED3.A
N$49
  Top 0.203: R21.1 25.81,54.66 26.01,54.86 26.01,59.54 27.23,60.76 29.26,60.76 29.26,54.86 LED4.A
N$50  (via drill 0.51)
  Top 0.203: v77.22,52.02 77.22,53.24 R24.2 | v83.52,44.3 83.72,44.5 83.72,45.31 X1.VBUS
  Bottom 0.203: v77.22,52.02 81.89,47.35 82.5,47.35 83.52,46.33 v83.52,44.3
N$51
  Top 0.203: R25.2 79.05,53.44 79.05,54.66 76.2,54.66 76,54.46 76,53.44 75.39,53.44 R24.1 75.18,53.24 75.18,44.09 74.37,43.28 74.37,40.64 SJ1.2
N$52  (via drill 0.51)
  Top 0.203: v77.22,43.28 78.44,43.28 IC6.16 | v81.89,46.13 83.72,46.13 X1.D-
  Bottom 0.203: v77.22,43.28 80.06,46.13 v81.89,46.13
N$53  (via drill 0.51)
  Top 0.203: v78.64,41.86 78.64,42.67 IC6.15 | v81.08,44.3 81.08,46.53 81.48,46.94 83.72,46.94 X1.D+
  Bottom 0.203: v78.64,41.86 v81.08,44.3
N$54
  Top 0.203: IC6.17 78.44,44.09 76.61,44.09 76.61,43.89 76.4,43.69 76.4,39.62 76,39.22 72.14,39.22 72.14,38.2 C22.1
N$55
  Top 0.203: LED5.A 86.16,39.42 87.99,39.42 R22.1
N$56
  Top 0.203: LED6.A 86.16,36.98 87.99,36.98 R23.1
N$57  (via drill 0.51)
  Top 0.203: v83.92,40.64 83.92,39.42 LED5.C | v80.06,46.94 79.65,46.94 79.65,47.95 78.64,47.95 IC6.23
  Bottom 0.203: v83.92,40.64 82.7,41.86 82.7,46.53 82.3,46.94 v80.06,46.94
N$58  (via drill 0.51)
  Top 0.203: v82.3,36.98 83.92,36.98 LED6.C | v77.22,47.55 77.62,47.55 77.62,47.35 78.03,47.35
  Top 0.254: 78.03,47.35 78.56,47.35 IC6.22
  Bottom 0.203: v82.3,36.98 76.4,42.88 76.4,47.55 v77.22,47.55
N$59
  Top 0.203: R26.2 73.15,53.24 73.15,52.02 72.75,51.61 71.32,51.61 71.32,51.21 IC6.1
N$60  (via drill 0.51)
  Top 0.203: v69.49,52.02 69.49,53.24 R27.2 | v72.75,48.77 71.32,48.77 IC6.5
  Bottom 0.203: v72.75,48.77 v69.49,52.02
N$61
  Top 0.203: SJ1.1 75.59,40.84 75.59,43.69 77.22,45.31 78.44,45.31 IC6.19
PB1  (via drill 0.51)
  Top 0.203: v35.36,36.17 37.8,36.17 IC3.11 | v25.81,32.51 19.1,39.22 19.1,40.64 SPI.7
  Bottom 0.203: v35.36,36.17 31.7,32.51 v25.81,32.51
PC0  (via drill 0.51)
  Top 0.203: v50.19,41.66 50.19,33.73 53.44,33.73 IC3.35 | v34.34,50.19 31.7,52.83 31.7,54.66 LED4.C
  Bottom 0.203: v50.19,41.66 48.97,42.88 41.66,42.88 v34.34,50.19
PC1  (via drill 0.51)
  Top 0.203: v51.82,44.5 51.82,34.54 53.44,34.54 IC3.36 | v47.55,52.63 46.94,53.24 46.94,54.46 LED3.C
  Bottom 0.203: v51.82,44.5 49.38,46.94 49.38,49.17 49.99,49.17 50.6,49.78 50.6,52.63 v47.55,52.63
PC2
  Top 0.203: IC3.37 53.65,35.36 55.68,35.36 55.68,53.03 55.07,53.65 55.07,55.47 56.08,56.49 61.98,56.49 61.98,54.66 LED2.C
RESET  (via drill 0.51)
  Top 0.203: v40.23,38.41 42.06,36.58 42.06,30.48 IC3.20 | SPI.3 15.44,40.64 15.44,50.8 15.65,51 16.46,51 16.46,52.02 JTAG.6 | v60.96,52.22 60.96,51 61.16,51 IC5.6
  Bottom 0.203: v40.23,38.41 39.62,39.01 15.65,39.01 15.04,39.62 15.04,40.64 SPI.3 | v60.96,52.22 59.54,53.65 18.49,53.65 17.68,52.83 16.87,52.83 16.87,52.22 16.66,52.22 JTAG.6
RX0  (via drill 0.51)
  Top 0.203: v35.76,38.2 35.76,43.28 37.8,43.28 IC3.2 | v70.1,39.62 74.17,43.69 74.17,54.66 72.14,54.66 72.14,53.44 71.53,53.44 R26.1
  Bottom 0.203: SPI.1 11.58,40.64 11.99,40.23 12.6,40.23 12.6,39.83 13.82,38.61 35.36,38.61 v35.76,38.2 36.37,37.59 40.64,37.59 41.45,38.41 68.89,38.41 v70.1,39.62
TCK  (via drill 0.51)
  Top 0.203: v43.69,41.66 45.11,43.08 45.11,45.52 45.31,45.72 IC3.57
  Bottom 0.203: v43.69,41.66 43.28,42.06 33.12,42.06 27.64,47.55 13.82,47.55 12.6,48.77 11.79,48.77 11.58,48.97 11.58,49.38 JTAG.1
TDI  (via drill 0.51)
  Top 0.203: v47.75,44.5 47.75,45.72 IC3.54 | v43.48,37.59 v49.99,44.09 | v26.01,37.19 25.4,37.8 v25.4,43.48 | v22.15,46.74 21.74,47.14 21.74,49.38 JTAG.9
  Bottom 0.203: v47.75,44.5 48.16,44.09 v49.99,44.09 | v43.48,37.59 43.08,37.19 v26.01,37.19 | v25.4,43.48 v22.15,46.74
TDO  (via drill 0.51)
  Top 0.203: v45.31,42.06 46.74,43.48 46.74,45.72 IC3.55
  Bottom 0.203: v45.31,42.06 44.91,42.47 33.33,42.47 27.84,47.95 15.65,47.95 15.04,48.56 15.04,49.38 14.02,49.38 JTAG.3
TMS  (via drill 0.51)
  Top 0.203: v45.92,47.95 45.92,45.92 IC3.56
  Bottom 0.203: v45.92,47.95 41.66,52.22 23.37,52.22 22.15,51 17.88,51 17.48,50.6 17.48,49.58 16.66,49.58 JTAG.5
TX0  (via drill 0.51)
  Top 0.203: v36.58,40.23 36.58,42.47 37.8,42.47 IC3.3 | v63.2,43.28 64.62,44.7 64.62,53.24 67.67,53.24 R27.1
  Bottom 0.203: 36.37,40.03 35.76,39.42 24.18,39.42 22.96,40.64 SPI.9 | v63.2,43.28 58.52,43.28 55.27,40.03 36.37,40.03 | 36.37,40.03 v36.58,40.23
VIN  (via drill 0.61)
  Top 0.61: C33.1 77.01,11.99 79.05,11.99 C19.2 79.05,12.19 79.05,14.63 78.84,14.63 IC2.25 78.64,15.04 78.44,15.04 v78.44,29.06 78.44,30.89 78.64,31.09 | C32.1 77.22,34.34 79.05,34.34 C18.2 78.64,34.14 78.64,31.09 | 78.64,31.09 IC2.43 | C31.1 17.68,12.19 19.3,12.19 C11.2 | C11.2 19.1,12.39 19.1,14.63 IC1.25 18.9,14.83 18.9,30.89 IC1.43 19.1,31.09 19.1,34.14 C9.2 19.3,34.34 17.48,34.34 C30.1 | 57.51,29.06 57.51,22.76 57.3,22.55 D3.A 56.9,22.35 56.9,20.32 55.27,20.32 53.85,18.9 53.85,3.86 48.36,3.86 POWER.1 | 57.51,29.06 57.51,48.16 R2.2 | v19.51,10.57 19.51,11.79 C11.2 | 57.51,29.06 v57.91,29.06
  Bottom 0.61: v19.51,10.57 20.32,9.75 40.64,9.75 46.33,4.06 47.95,4.06 48.16,3.86 POWER.1 | v57.91,29.06 v78.44,29.06

### Text on the board
tPlace: LEFT | Sig | +5 | RIGHT | Micromouse 2009 | v1.5 | JTAG | RX | ICSP | TX | SW0 | RESET | A | A# | B | B# | - | +